# Altium project LDC10.PrjPCB
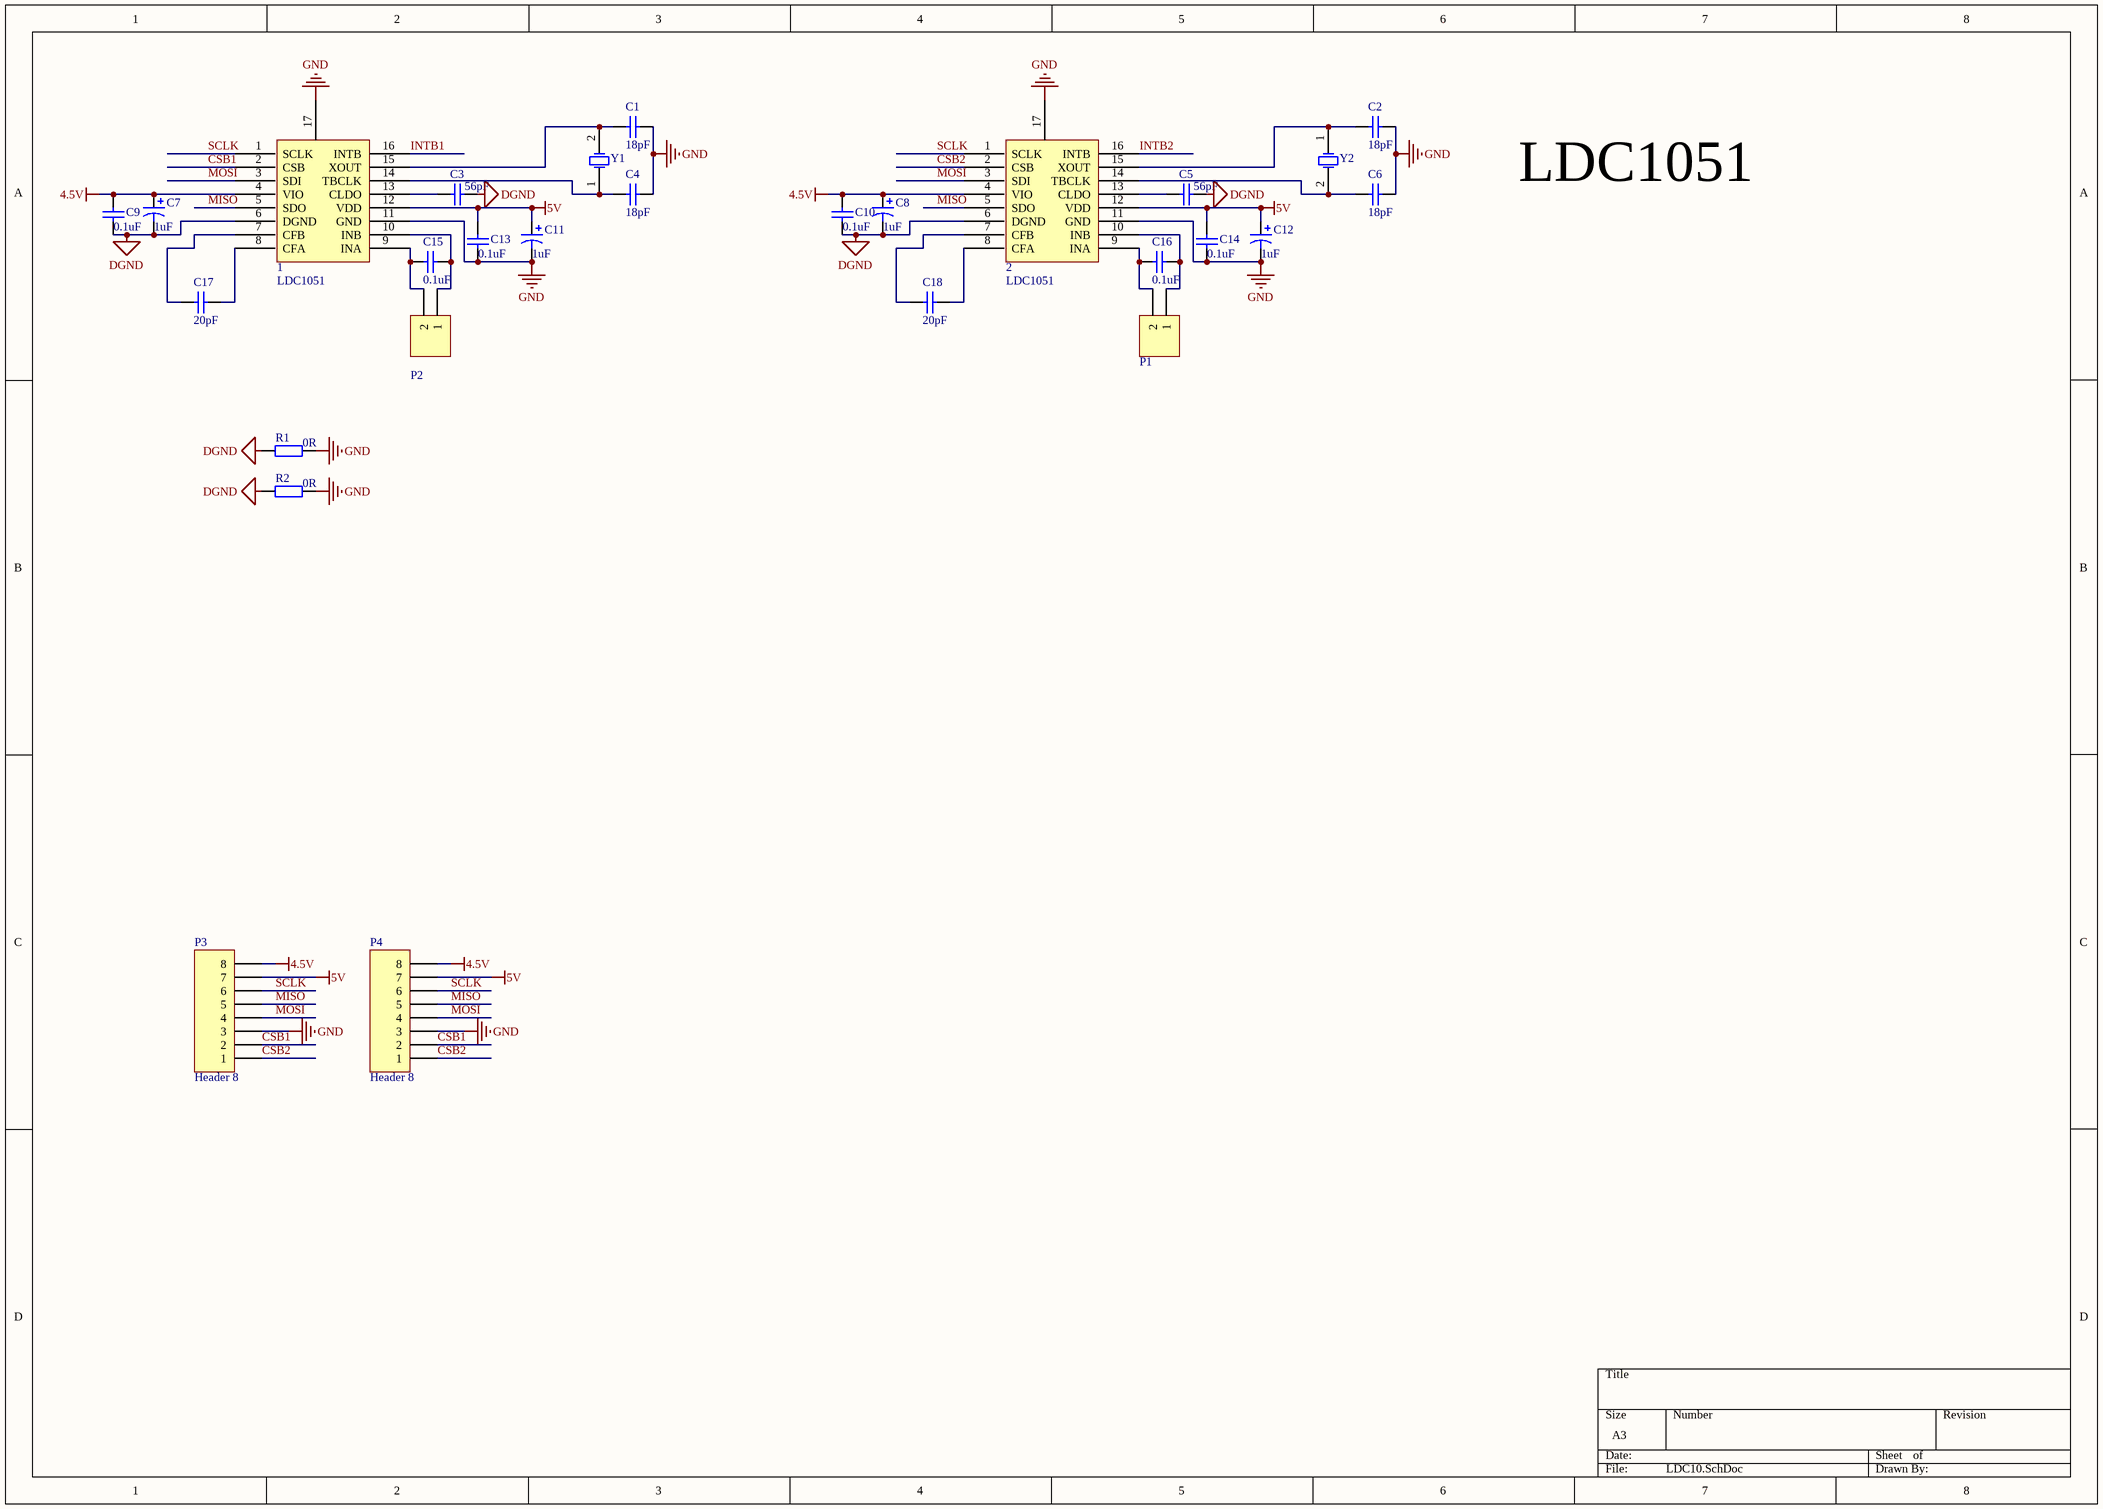
[diagram p0: LDC10.SchDoc]
1 sheet, 28 parts. Net scope: global (net labels, ports and power ports of the same name join across sheets).
Board file: LDC10.PcbDoc

## Sheet LDC10.SchDoc
size A3

### Parts
1  LDC1051  [LDC1000]
2  LDC1051  [LDC1000]
C1  value 18pF  [C2012]  (hidden comment: Cap)
C2  value 18pF  [C2012]  (hidden comment: Cap)
C3  value 56pF  [C2012]  (hidden comment: Cap)
C4  value 18pF  [C2012]  (hidden comment: Cap)
C5  value 56pF  [C2012]  (hidden comment: Cap)
C6  value 18pF  [C2012]  (hidden comment: Cap)
C7  value 1uF  [C2012]  (hidden comment: Cap Pol1)
C8  value 1uF  [C2012]  (hidden comment: Cap Pol1)
C9  value 0.1uF  [C2012]  (hidden comment: Cap)
C10  value 0.1uF  [C2012]  (hidden comment: Cap)
C11  value 1uF  [C2012]  (hidden comment: Cap Pol1)
C12  value 1uF  [C2012]  (hidden comment: Cap Pol1)
C13  value 0.1uF  [C2012]  (hidden comment: Cap)
C14  value 0.1uF  [C2012]  (hidden comment: Cap)
C15  value 0.1uF  [C2012]  (hidden comment: Cap)
C16  value 0.1uF  [C2012]  (hidden comment: Cap)
C17  value 20pF  [C2012]  (hidden comment: Cap)
C18  value 20pF  [C2012]  (hidden comment: Cap)
P1  Header 2  [HDR1X2]  (value not drawn)
P2  Header 2  [HDR1X2]  (value not drawn)
P3  Header 8  [HDR1X8]
P4  Header 8  [HDR1X8]
R1  value 0R  [1206(2)]  (hidden comment: Res2)
R2  value 0R  [1206(2)]  (hidden comment: Res2)
Y1  XTAL  [XTAL-RAD-0.2]  (value not drawn)
Y2  XTAL  [XTAL-RAD-0.2]  (value not drawn)

### Nets
4.5V: 1.4(VIO) 2.4(VIO) C7.1 C8.1 C9.2 C10.2 P3.8 P4.8
5V: 1.12(VDD) 2.12(VDD) C11.1 C12.1 C13.2 C14.2 P3.7 P4.7
DGND: 1.6(DGND) 2.6(DGND) C3.1 C5.1 C7.2 C8.2 C9.1 C10.1 R1.2 R2.2
GND: 1.11(GND) 1.17(GND) 2.11(GND) 2.17(GND) C1.1 C2.1 C4.1 C6.1 C11.2 C12.2 C13.1 C14.1 P3.3 P4.3 R1.1 R2.1
CSB1: 1.2(CSB) P3.2 P4.2
CSB2: 2.2(CSB) P3.1 P4.1
INTB1: 1.16(INTB)
INTB2: 2.16(INTB)
MISO: 1.5(SDO) 2.5(SDO) P3.5 P4.5
MOSI: 1.3(SDI) 2.3(SDI) P3.4 P4.4
SCLK: 1.1(SCLK) 2.1(SCLK) P3.6 P4.6
Net1_7: 1.7(CFB) C17.2
Net1_8: 1.8(CFA) C17.1
Net1_9: 1.9(INA) C15.2 P2.2
Net1_10: 1.10(INB) C15.1 P2.1
Net1_13: 1.13(CLDO) C3.2
Net1_14: 1.14(TBCLK) C4.2 Y1.1(OSC1)
Net1_15: 1.15(XOUT) C1.2 Y1.2(OSC2)
Net2_7: 2.7(CFB) C18.2
Net2_8: 2.8(CFA) C18.1
Net2_9: 2.9(INA) C16.2 P1.2
Net2_10: 2.10(INB) C16.1 P1.1
Net2_13: 2.13(CLDO) C5.2
Net2_14: 2.14(TBCLK) C6.2 Y2.2(OSC2)
Net2_15: 2.15(XOUT) C2.2 Y2.1(OSC1)

### Notes on the sheet
- LDC1051

### Library data of the parts
1 2 = LDC1000
C1-C6 C9 C10 C13-C18 = Cap: Capacitor; Published: 8-Jun-2000; LatestRevisionDate: 17-Jul-2002; LatestRevisionNote: Re-released for DXP Platform.; PackageReference: RAD-0.3; Publisher: Altium Limited; PackageDescription: Radial Cap, Thru-Hole; 2 Leads; 0.3 in Pin Spacing
C7 C8 C11 C12 = Cap Pol1: Polarized Capacitor (Radial); Published: 8-Jun-2000; LatestRevisionDate: 17-Jul-2002; LatestRevisionNote: Re-released for DXP Platform.; PackageReference: RB7.6-15; Publisher: Altium Limited; PackageDescription: Polarized Capacitor (Radial); 2 Leads
P1 P2 = Header 2: Header, 2-Pin; LatestRevisionDate: 17-Jul-2002; LatestRevisionNote: Re-released for DXP Platform.; Publisher: Altium Limited
P3 P4 = Header 8: Header, 8-Pin; LatestRevisionDate: 17-Jul-2002; LatestRevisionNote: Re-released for DXP Platform.; Publisher: Altium Limited
R1 R2 = Res2: Resistor; Published: 8-Jun-2000; LatestRevisionDate: 17-Jul-2002; LatestRevisionNote: Re-released for DXP Platform.; PackageReference: AXIAL-0.4; Publisher: Altium Limited; PackageDescription: Axial Device, Thru-Hole; 2 Leads; 0.4 in Pin Spacing
Y1 Y2 = XTAL: 晶体振荡器; Published: 8-Jun-2000; LatestRevisionDate: 17-Jul-2002; LatestRevisionNote: Re-released for DXP Platform.; PackageReference: R38; Publisher: Altium Limited